# Altium schematic sheet Chov2_main.SchDoc
size A4; DocumentNumber: 1; SheetNumber: 1; SheetTotal: 3; LotOfPieces: 1
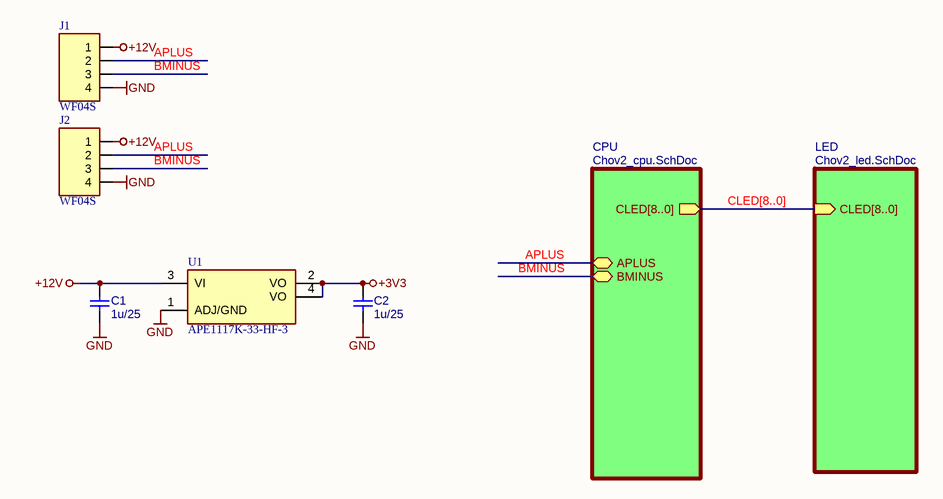
[diagram p0: Chov2_main.SchDoc]

## Parts
C1  OtherParams: 1u/25  [0805]  (hidden comment: CL21B105KAFNNNG)
C2  OtherParams: 1u/25  [0805]  (hidden comment: CL21B105KAFNNNG)
J1  WF04S  [WF04S]
J2  WF04S  [WF04S]
U1  APE1117K-33-HF-3  [SOT-223]

## Sub-sheets
CPU = Chov2_cpu.SchDoc: CLED[8..0], APLUS, BMINUS
LED = Chov2_led.SchDoc: CLED[8..0]

## Nets
+3V3: C2.1 U1.2(VO) U1.4(VO)
+12V: C1.1 J1.1 J2.1 U1.3(VI)
GND: C1.2 C2.2 J1.4 J2.4 U1.1(ADJ/GND)
APLUS: J1.2 J2.2 ; sheet CPU/APLUS
BMINUS: J1.3 J2.3 ; sheet CPU/BMINUS

## Buses and harness runs
bus CLED[8..0] = sheet CPU/CLED[8..0] = sheet LED/CLED[8..0]

## Notes on the sheet
- Wariant:
- Projekt i wykonanie: (C) Miroslaw Lach MRQ, www.mlach.com
- SVNPath:
- Page:
- Rev.
- /
- Plik:

## Library data of the parts
C1 C2 = CL21B105KAFNNNG[[/\]]0805[[/\]]25V[[/\]]10%[[/\]]1u/25: MaxVoltage: 25V; Tolerance: 10%; Descript: Kondensator: ceramiczny; MLCC; 1uF; 25V; X7R; ±10%; SMD; 0805; Currency5: PLN; Value: CL21B105KAFNNNG; Dimensions: 0805; Supplier5: tme.pl; Reference5: CL21B105KAFNNNG; Manufacturer5: Samsung; Typ5: CL21B105KAFNNNG; Price5: 0,051; DateOfPrice5: 2016-08-23
J1 J2 = WF04S[[/\]]WF04S: Descript: connector 2.54mm pitch, THT, 4 pole, straight, male; Currency5: PLN; Value: WF04S; Dimensions: WF04S; Supplier5: maritex.com.pl; Reference5: WF04S; Price5: 0,069; DateOfPrice5: 2015-01-26; ComponentLink1Description: Datasheet; ComponentLink1URL: http://www.mrq-ml.com/Parts/Connectors/WFXXS.pdf; Price1: 0,0690
U1 = APE1117K-33-HF-3[[/\]]SOT-223: Descript: 1000mA low-dropout linear regulator 3.3V; Typ5: APE1117K-33-HF-3TR; Currency5: PLN; Value: APE1117K-33-HF-3; Dimensions: SOT-223; ComponentLink1Description: Datasheet; ComponentLink1URL: ftp://s2.zenbox.pl/ICs/APE1117-3.pdf; Supplier5: tme.pl; Reference5: APE1117K-33-HF-3; Manufacturer5: APEC; Price5: 1; DateOfPrice5: 2016-06-06